# EAGLE design i2cspilcdbackpack (EAGLE 6.1)
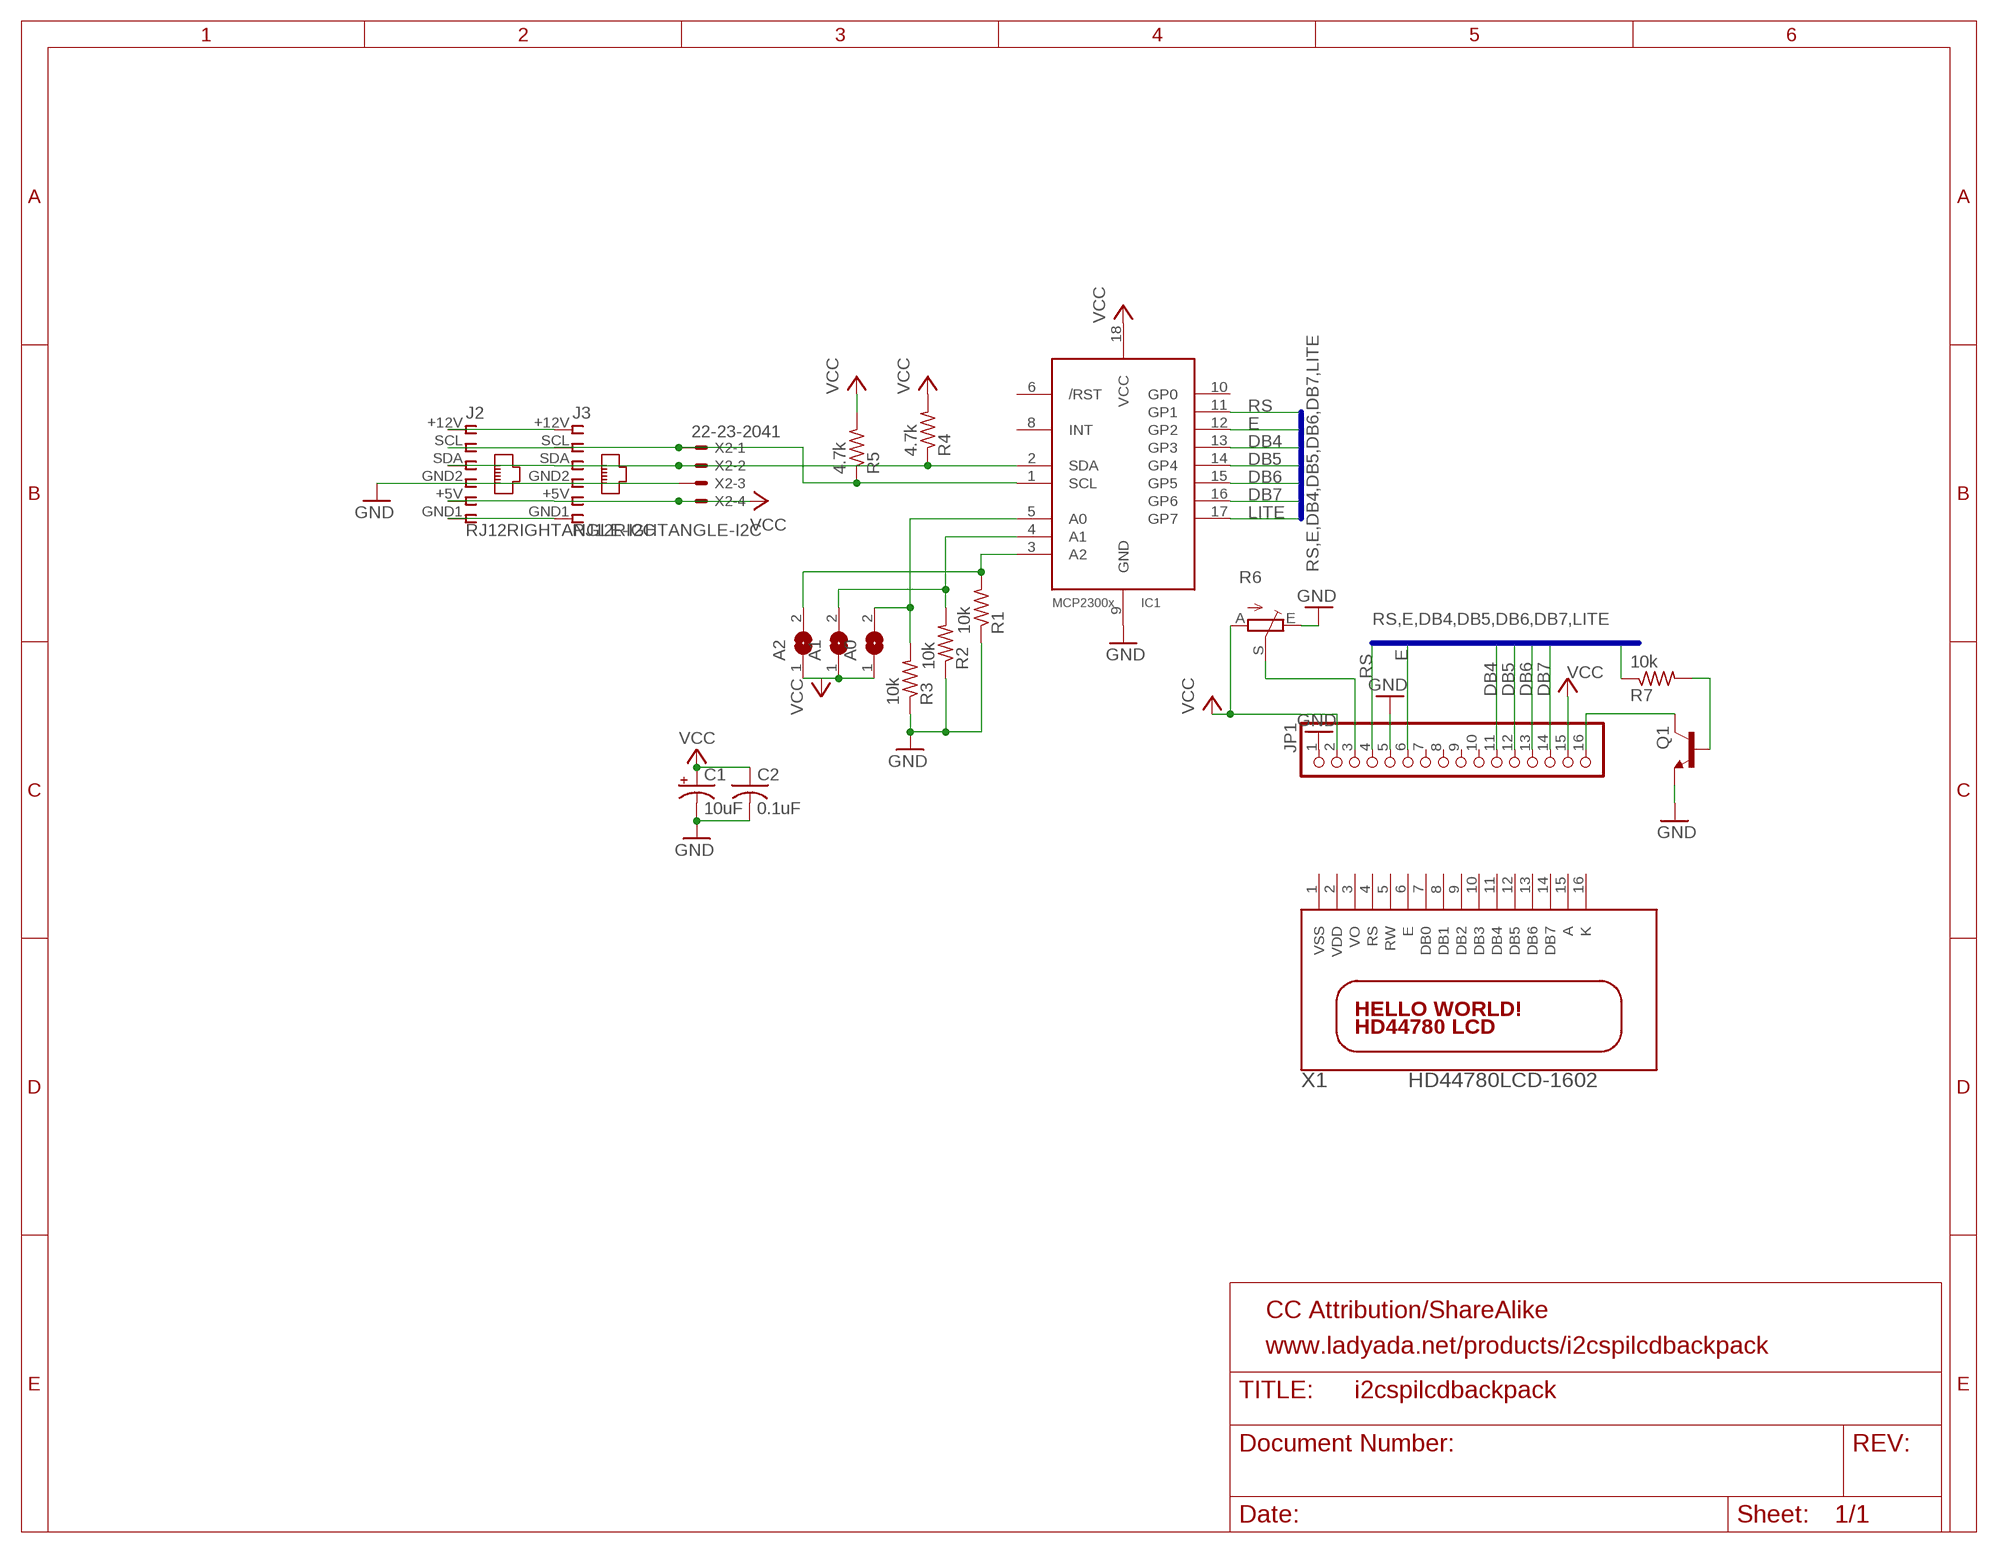
[diagram p0: schematic, sheet 1]

## Parts
A0  SJ  [SJ]
A1  SJ  [SJ]
A2  SJ  [SJ]
C1  10uF  CPOL-USA/3216-18R  [A/3216-18R]
C2  0.1uF  C-USC1206  [C1206]
IC1  MCP2300X/P  [DIL18]
J2  RJ12RIGHTANGLE-I2C  [RJ12-RIGHTANGLE-I2C]
J3  RJ12RIGHTANGLE-I2C  [RJ12-RIGHTANGLE-I2C]
JP1  PINHD-1X16  [1X16]
Q1  MMBT2222ALT1-NPN-SOT23-BEC  [SOT23-BEC]
R1  10k  R-US_M1206  [M1206]
R2  10k  R-US_M1206  [M1206]
R3  10k  R-US_M1206  [M1206]
R4  4.7k  R-US_M1206  [M1206]
R5  4.7k  R-US_M1206  [M1206]
R6  TRIM_EU-CA9V  [CA9V]
R7  10k  R-US_M1206  [M1206]
X1  HD44780LCD-1602  [LCD1602]
X2  22-23-2041  [22-23-2041]

## Nets
CLOCK: IC1.1(SCL) J2.SCL J3.SCL R5.1 X2.1
DATA: IC1.2(SDA) J2.SDA J3.SDA R4.1 X2.2
DB4: IC1.13(GP3) JP1.11
DB5: IC1.14(GP4) JP1.12
DB6: IC1.15(GP5) JP1.13
DB7: IC1.16(GP6) JP1.14
E: IC1.12(GP2) JP1.6
GND [power]: C1.- C2.2 IC1.9(GND) J2.GND2 J3.GND2 JP1.1 JP1.5 Q1.E R1.1 R2.1 R3.1 R6.E X2.3
LITE: IC1.17(GP7) R7.1
N$1: A0.2 IC1.5(A0) R3.2
N$2: A1.2 IC1.4(A1) R2.2
N$3: A2.2 IC1.3(A2) R1.2
N$4 [power]: J2.+12V J3.+12V
N$7: JP1.16 Q1.C
N$9: Q1.B R7.2
N$10: JP1.3 R6.S
N$11 [power]: J2.GND1 J3.GND1
RS: IC1.11(GP1) JP1.4
VCC [power]: A0.1 A1.1 A2.1 C1.+ C2.1 IC1.18(VCC) J2.+5V J3.+5V JP1.2 JP1.15 R4.2 R5.2 R6.A X2.4
Unconnected: IC1.6(/RST) IC1.8(INT) IC1.10(GP0) JP1.7 JP1.8 JP1.9 JP1.10 X1.1(VSS) X1.2(VDD) X1.3(VO) X1.4(RS) X1.5(RW) X1.6(E) X1.7(DB0) X1.8(DB1) X1.9(DB2) X1.10(DB3) X1.11(DB4) X1.12(DB5) X1.13(DB6) X1.14(DB7) X1.15(A) X1.16(K)

## Buses
RS,E,DB4,DB5,DB6,DB7,LITE

## Notes on the sheet
- CC Attribution/ShareAlike
- www.ladyada.net/products/i2cspilcdbackpack

## Library data of the parts
A0 A1 A2 = jumper:SJ: SMD solder JUMPER
C1 = adafruit:CPOL-US: POLARIZED CAPACITOR, American symbol
C2 = adafruit:C-US: CAPACITOR, American symbol
IC1 = adafruit:MCP2300X: MCP23008 Inexpensive i2c i/o expander - 8 general purpose i/o pins with optional pullups
J2 J3 = lpatiny:RJ12: CORCOM Modular RJ Jacks No Shield Source: www.tycoelectronics.com .. ENG_DS_1654001_1099_RJ_L_0507.pdf
JP1 = pinhead:PINHD-1X16: PIN HEADER
Q1 = transistor:*-NPN-: NPN Transistror BF959 corrected 2008.03.06
R1-R5 R7 = adafruit:R-US_: RESISTOR, American symbol
R6 = pot:TRIM_EU-: POTENTIOMETER
X1 = adafruit:HD44780LCD: HD44780 LCD Standard character type LCDs, available in sizes from 8x1 to 40x4!
X2 = con-molex:22-23-2041: .100" (2.54mm) Center Header - 4 Pin; MF: MOLEX; MPN: 22-23-2041; OC_FARNELL: 1462920; OC_NEWARK: 38C0355

## Net classes
0 default: width 0.4 mm
1 power: width 0.8 mm

## Board
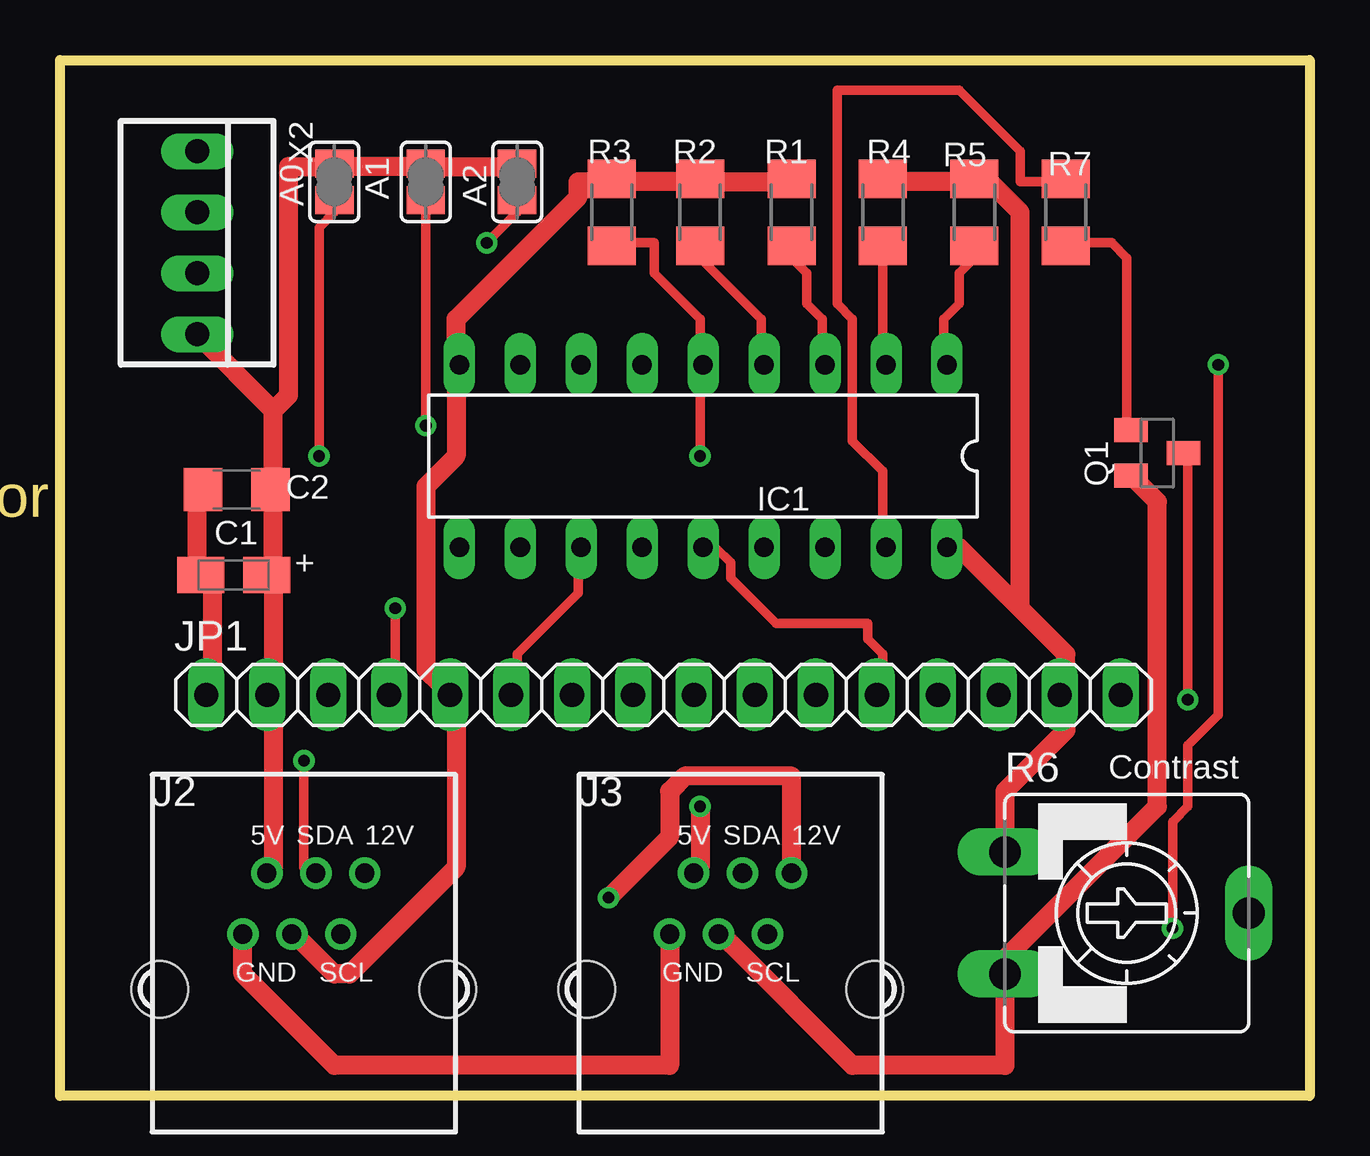
[diagram p1: board, top side]
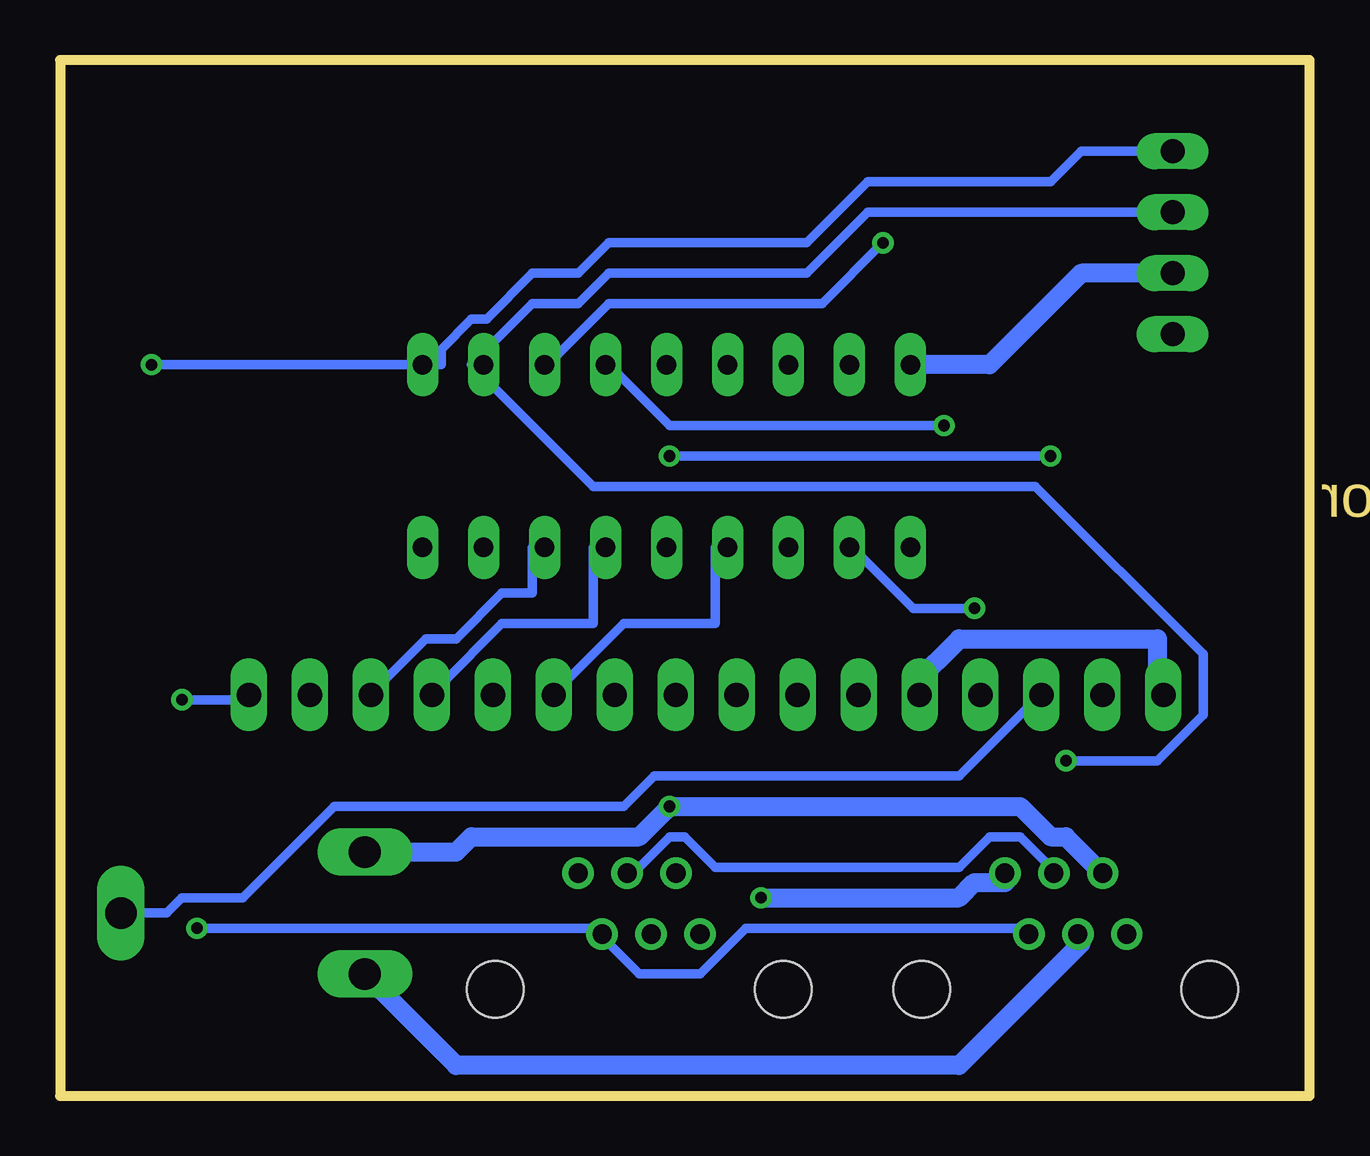
[diagram p2: board, bottom side, seen from below]

Size 52.07 x 43.18 mm. Coordinates in mm from the lower left corner, seen from the top.
Outline: 0,0 0,43.18 52.07,43.18 52.07,0 0,0
Copper layers (1*16): Top 0.035mm / dielectric 1.5mm / Bottom 0.035mm
Design rules: minimum track width 10mil, minimum drill 19mil, track to track 10mil, track to pad 10mil, pad to pad 10mil, via to via 10mil, smd to smd 10mil, copper to edge 20mil, drill to drill 8mil, minimum pad ring 10mil, minimum via ring 8mil, stop-mask expansion 4mil, vias tented up to drill 20mil, thermal gap 10mil
Milling: 4 lines

### Footprints (pad centres in the part's own frame; a part is rotated, then mirrored left to right if it is on the bottom)
SJ = smd 1.168 x 1.6: 1 -0.762,0; 2 0.762,0
A/3216-18R = smd 1.95 x 1.5: + 1.375,0; - -1.375,0
C1206 = smd 1.6 x 1.8: 1 -1.4,0; 2 1.4,0
DIL18 = drill 0.813 long: 1 -10.16,-3.81; 2 -7.62,-3.81; 3 -5.08,-3.81; 4 -2.54,-3.81; 5 0,-3.81; 6 2.54,-3.81; 7 5.08,-3.81; 8 7.62,-3.81; 9 10.16,-3.81; 10 10.16,3.81; 11 7.62,3.81; 12 5.08,3.81; 13 2.54,3.81; 14 0,3.81; 15 -2.54,3.81; 16 -5.08,3.81; 17 -7.62,3.81; 18 -10.16,3.81
RJ12-RIGHTANGLE-I2C = drill 0.8 pad 1.3: +5V -1.54,4.84; +12V 2.54,4.84; GND1 -2.54,2.3; GND2 -0.5,2.3; SCL 1.54,2.3; SDA 0.5,4.84 | hole 2.36: -6,0; 6,0
1X16 = drill 1.016 long: 1 -19.05,0; 2 -16.51,0; 3 -13.97,0; 4 -11.43,0; 5 -8.89,0; 6 -6.35,0; 7 -3.81,0; 8 -1.27,0; 9 1.27,0; 10 3.81,0; 11 6.35,0; 12 8.89,0; 13 11.43,0; 14 13.97,0; 15 16.51,0; 16 19.05,0
SOT23-BEC = smd 1 x 1.4: B -0.95,-1.1; C 0,1.1; E 0.95,-1.1
M1206 = smd 1.6 x 2: 1 -1.4,0; 2 1.4,0
CA9V = drill 1.321 long: A -2.54,-5.08; E 2.54,-5.08; S 0,5.08
LCD1602 = drill 0.8 long: 1 8,33.46; 2 10.54,33.46; 3 13.08,33.46; 4 15.62,33.46; 5 18.16,33.46; 6 20.7,33.46; 7 23.24,33.46; 8 25.78,33.46; 9 28.32,33.46; 10 30.86,33.46; 11 33.4,33.46; 12 35.94,33.46; 13 38.48,33.46; 14 41.02,33.46; 15 43.56,33.46; 16 46.1,33.46 | hole 2.8: 2.54,2.54; 2.54,33.46; 77.46,33.46; 77.46,2.54
22-23-2041 = drill 1 long: 1 -3.81,0; 2 -1.27,0; 3 1.27,0; 4 3.81,0

### Placement (x,y rotation side)
A0  11.43,38.1 270 top
A1  15.24,38.1 270 top
A2  19.05,38.1 270 top
C1  7.24,21.72 0 top
C2  7.37,25.27 180 top
IC1  26.8,26.67 180 top
J2  10.16,4.45 0 top
J3  27.94,4.45 0 top
JP1  25.15,16.71 0 top
Q1  45.72,26.8 270 top
R1  30.48,36.83 270 top
R2  26.67,36.83 270 top
R3  22.99,36.83 270 top
R4  34.29,36.83 90 top
R5  38.1,36.83 90 top
R6  44.45,7.62 270 top
R7  41.91,36.83 270 top
X1  101.6,89.53 180 top  (outside the outline)
X2  5.71,35.56 270 top

### Tracks (layer width: path | path; a pad name or v marks a point on that pad's centre or on a via)
CLOCK  (via drill 0.48)
  Top 0.4: R5.1 38.1,34.92 37.47,34.29 37.47,33.02 36.83,32.38 36.83,30.48 IC1.1 | v46.35,6.99 46.35,11.43 46.99,12.06 46.99,14.61 48.26,15.88 v48.26,30.48
  Bottom 0.4: J2.SCL 12.06,6.99 23.5,6.99 25.4,5.08 27.94,5.08 29.21,6.35 J3.SCL 29.84,6.99 v46.35,6.99 | X2.1 9.53,39.37 10.79,38.1 18.41,38.1 20.95,35.56 29.21,35.56 30.48,34.29 32.38,34.29 34.29,32.38 34.92,32.38 36.2,31.11 36.2,30.48 IC1.1 v48.26,30.48
DATA  (via drill 0.48)
  Top 0.4: R4.1 34.29,30.48 IC1.2 | v10.16,13.97 10.16,9.53 J2.SDA
  Bottom 0.4: J3.SDA 27.94,9.53 26.67,10.79 26.04,10.79 24.77,9.53 14.61,9.53 13.34,10.79 12.06,10.79 10.79,9.53 J2.SDA | X2.2 18.41,36.83 20.95,34.29 29.21,34.29 30.48,33.02 32.38,33.02 34.92,30.48 | v10.16,13.97 6.35,13.97 4.45,15.88 4.45,18.41 11.43,25.4 29.84,25.4 34.92,30.48 | 34.92,30.48 IC1.2
DB4
  Bottom 0.4: IC1.13 24.77,22.86 24.77,19.68 28.57,19.68 31.11,17.14 JP1.11
DB5
  Top 0.4: IC1.14 27.3,22.86 27.94,22.23 27.94,21.59 29.84,19.68 33.66,19.68 33.66,19.05 34.29,18.41 34.29,17.14 JP1.12
DB6
  Bottom 0.4: IC1.15 29.84,22.86 29.84,19.68 33.66,19.68 36.2,17.14 JP1.13
DB7
  Bottom 0.4: IC1.16 32.38,22.86 32.38,20.95 33.66,20.95 35.56,19.05 36.83,19.05 38.73,17.14 JP1.14
E
  Top 0.4: IC1.12 21.59,22.86 21.59,20.95 19.05,18.41 19.05,17.14 JP1.6
GND
  Top 0.8: Q1.E 45.09,25.4 45.72,24.77 45.72,12.06 39.37,5.71 R6.E 39.37,1.27 33.02,1.27 27.94,6.35 J3.GND2 | C2.2 5.71,24.77 5.71,22.23 C1.- 6.35,21.59 6.35,17.14 JP1.1 | J2.GND2 10.16,6.35 11.43,5.08 12.06,5.08 16.51,9.53 16.51,16.51 JP1.5 15.88,17.14 15.24,17.78 15.24,25.4 16.51,26.67 16.51,30.48 | 26.67,38.1 23.5,38.1 R3.1 22.86,38.1 21.59,38.1 21.59,37.47 16.51,32.38 16.51,30.48 | 26.67,38.1 30.48,38.1 R1.1 | 26.67,38.1 R2.1 | 16.51,30.48 IC1.9
  Bottom 0.8: JP1.1 6.35,17.14 6.35,19.05 14.61,19.05 16.51,17.14 JP1.5 | IC1.9 13.34,30.48 9.53,34.29 X2.3 | R6.E 35.56,1.27 14.61,1.27 9.53,6.35 J2.GND2
LITE
  Top 0.4: R7.1 41.91,38.1 40.01,38.1 40.01,39.37 37.47,41.91 32.38,41.91 32.38,33.02 33.02,32.38 33.02,27.3 34.29,26.04 34.29,22.86 IC1.17
N$1  (via drill 0.48)
  Top 0.4: v10.79,26.67 10.79,36.2 11.43,36.83 A0.2 | 26.67,30.48 v26.67,26.67 | 26.67,30.48 26.67,32.38 24.77,34.29 24.77,35.56 23.5,35.56 R3.2 | 26.67,30.48 IC1.5
  Bottom 0.4: v26.67,26.67 v10.79,26.67
N$2  (via drill 0.48)
  Top 0.4: v15.24,27.94 A1.2 | R2.2 26.67,34.92 29.21,32.38 29.21,30.48 IC1.4
  Bottom 0.4: v15.24,27.94 26.67,27.94 29.21,30.48 IC1.4
N$3  (via drill 0.48)
  Top 0.4: v17.78,35.56 19.05,36.83 A2.2 | R1.2 30.48,34.92 31.11,34.29 31.11,33.02 31.75,32.38 31.75,30.48 IC1.3
  Bottom 0.4: v17.78,35.56 20.32,33.02 29.21,33.02 31.75,30.48 IC1.3
N$4  (via drill 0.48)
  Top 0.8: v22.86,8.26 25.4,10.79 25.4,12.7 26.04,13.34 30.48,13.34 J3.+12V
  Bottom 0.8: v22.86,8.26 14.61,8.26 13.97,8.89 12.7,8.89 J2.+12V
N$7  (via drill 0.48)
  Top 0.4: v46.99,16.51 46.99,26.67 Q1.C
  Bottom 0.4: v46.99,16.51 44.45,16.51 JP1.16
N$9
  Top 0.4: Q1.B 44.45,27.94 44.45,34.92 43.81,35.56 41.91,35.56 R7.2
N$10
  Bottom 0.4: R6.S 47.62,7.62 46.99,8.26 44.45,8.26 40.64,12.06 28.57,12.06 27.3,13.34 14.61,13.34 11.43,16.51 JP1.3
N$11
  Top 0.8: J2.GND1 7.62,5.08 11.43,1.27 25.4,1.27 J3.GND1
RS  (via drill 0.48)
  Top 0.4: v13.97,20.32 13.97,17.14 JP1.4
  Bottom 0.4: v13.97,20.32 16.51,20.32 19.05,22.86 IC1.11
VCC  (via drill 0.48)
  Top 0.8: J2.+5V 8.89,9.53 8.89,16.51 JP1.2 8.89,17.14 8.89,21.59 C1.+ 8.89,22.23 8.89,24.77 C2.1 8.89,25.4 8.89,28.57 | 15.24,38.73 11.43,38.73 | 15.24,38.73 19.05,38.73 A2.1 | 15.24,38.73 A1.1 | 8.89,28.57 X2.4 | 11.43,38.73 9.53,38.73 9.53,29.21 8.89,28.57 | 11.43,38.73 A0.1 | v26.67,12.06 26.67,9.53 J3.+5V | 38.1,38.1 34.29,38.1 R4.2 | 40.01,20.32 41.91,18.41 41.91,17.14 JP1.15 41.91,16.51 41.91,15.24 39.37,12.7 R6.A | 40.01,20.32 37.47,22.86 IC1.18 | 38.1,38.1 38.73,38.1 40.01,36.83 40.01,20.32 | 38.1,38.1 R5.2
  Bottom 0.8: R6.A 35.56,10.16 34.92,10.79 27.94,10.79 v26.67,12.06 12.06,12.06 10.79,10.79 10.16,10.79 8.89,9.53 J2.+5V

### Text on the board
Dimension: 10uF polarised ? | equivalent transistor
tPlace: Contrast